# EasyEDA schematic 1-Schematic_IRWAVER_MODULE.json
TITLE: Sheet_1; REV: 1.0; Date: 2022-12-25; Sheet: 1/1; Drawn By: maarnotto; Company: Your Company
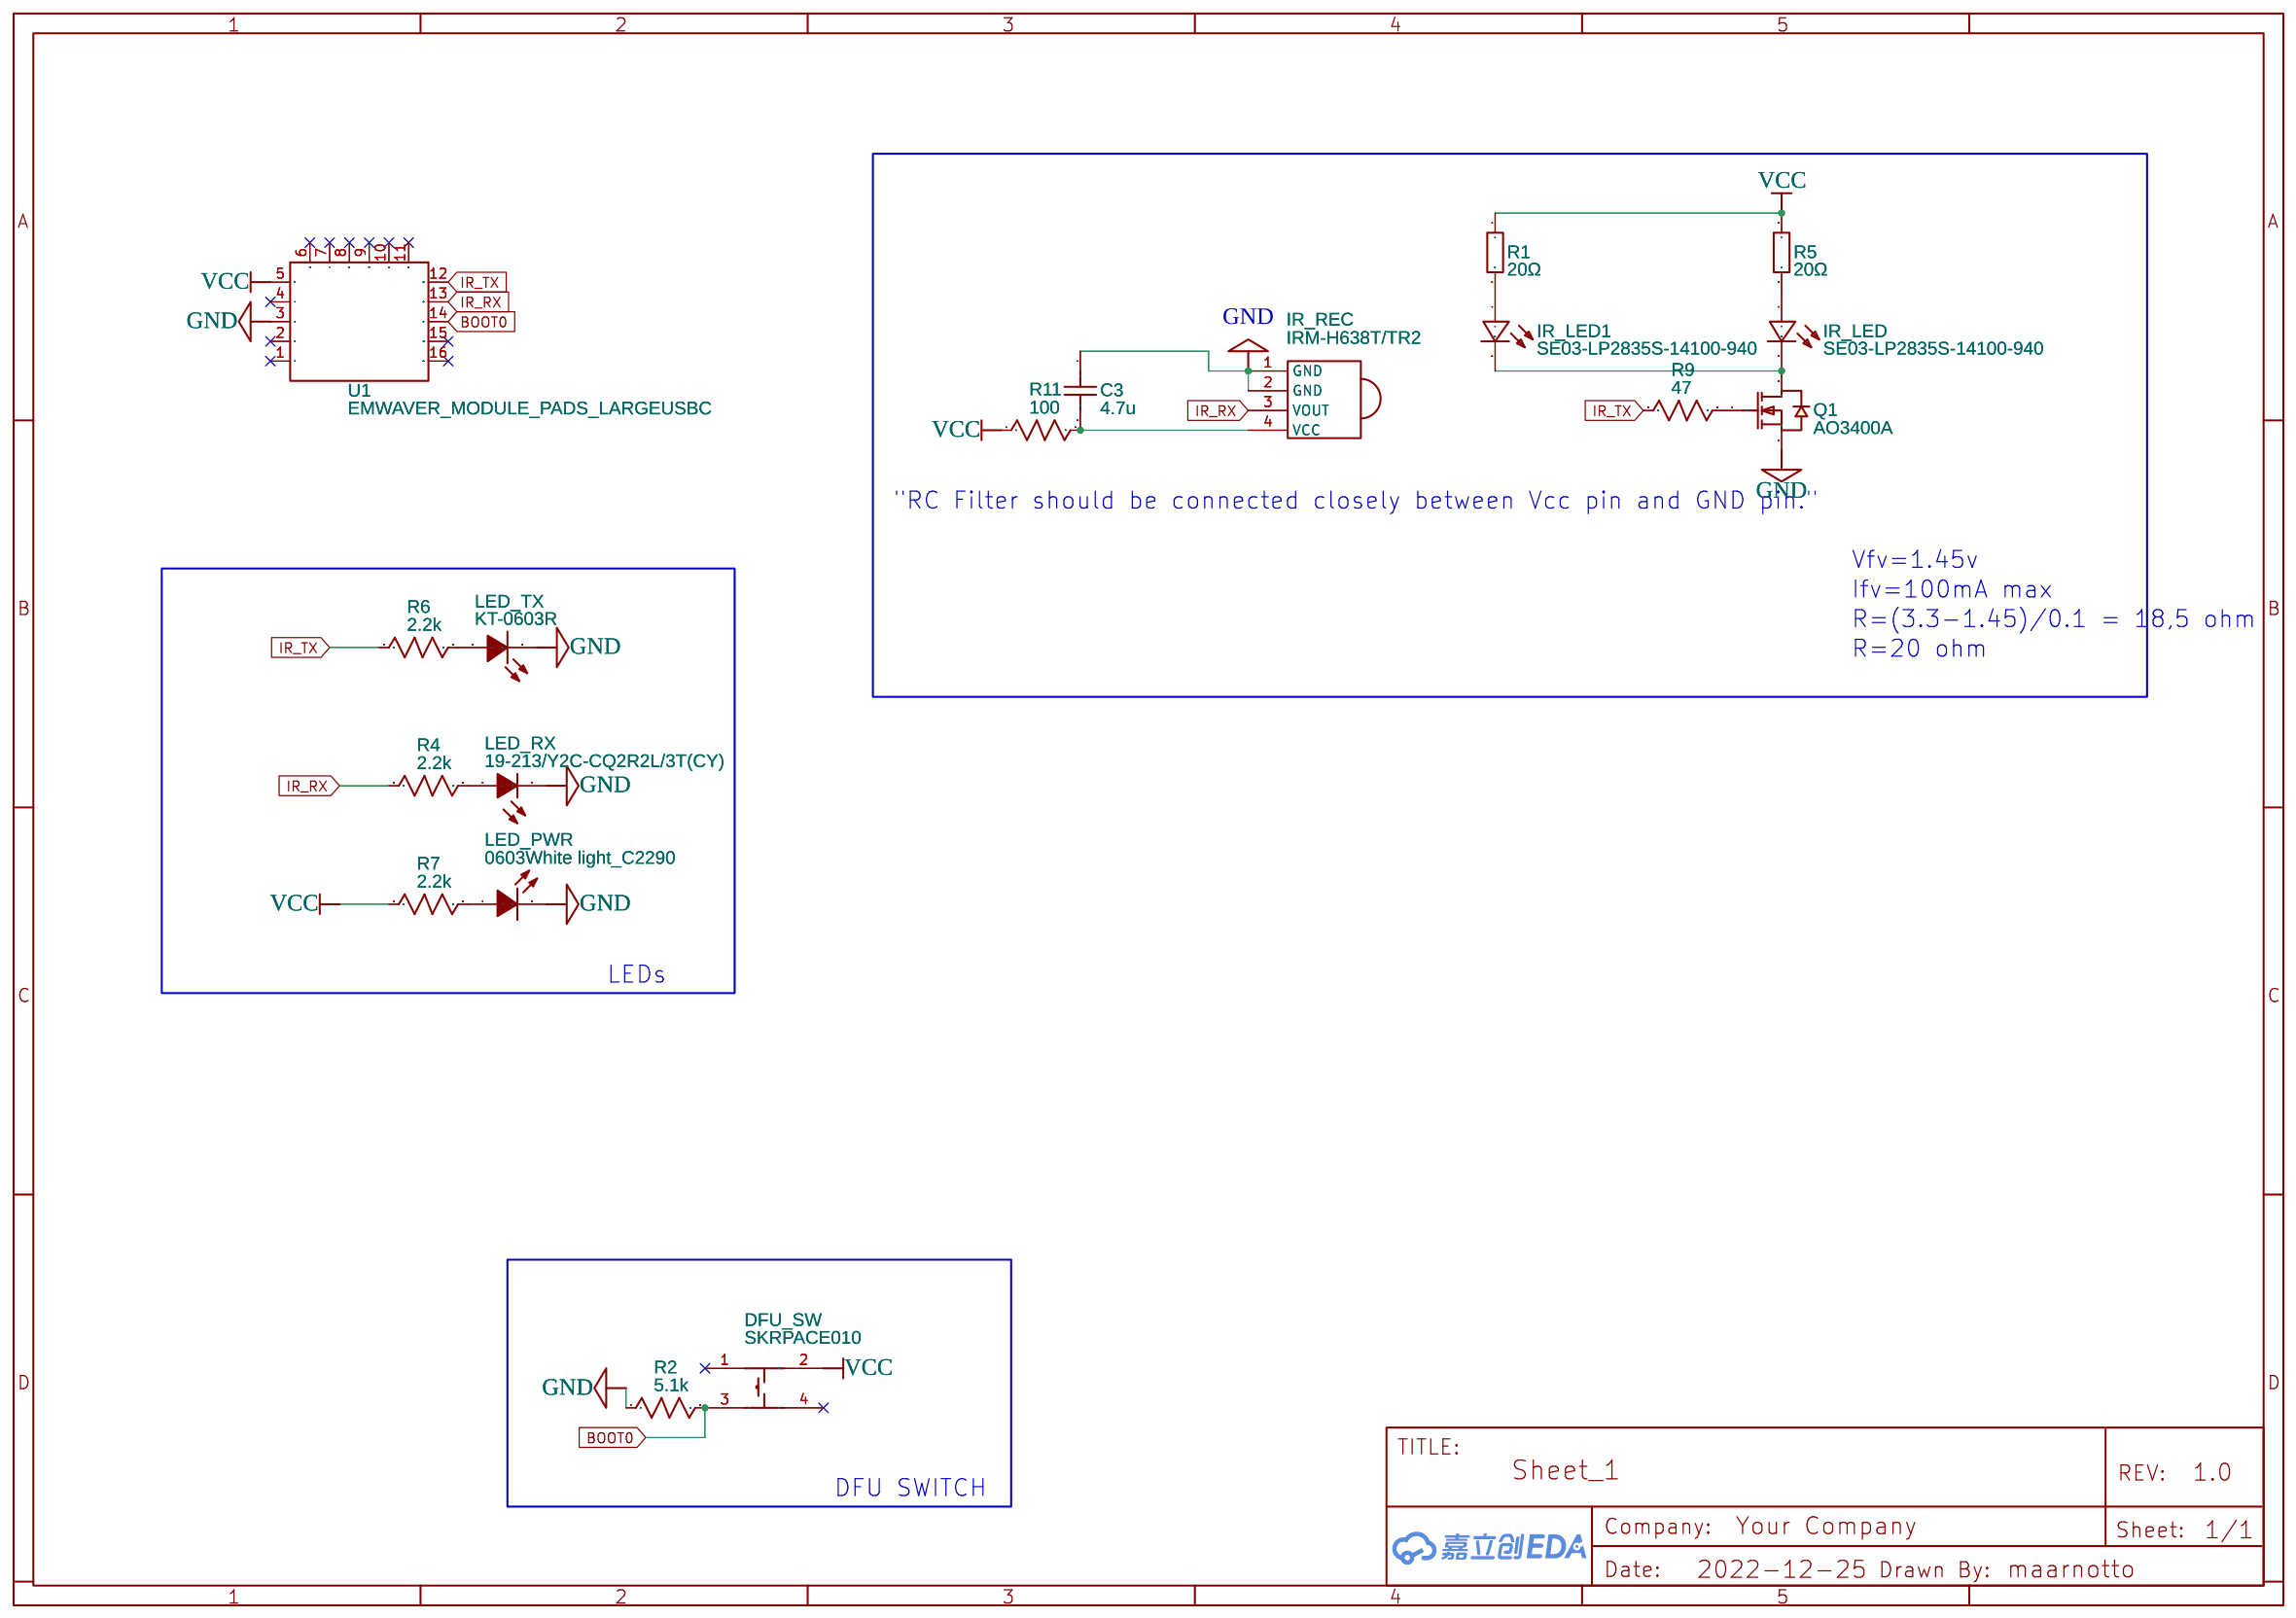
[diagram p0: schematic sheet]

## Parts
C3  4.7u  [C0603]
DFU_SW  SKRPACE010  [KEY-SMD_4P-L4.2-W3.2-P2.20-LS4.6]
IR_LED  SE03-LP2835S-14100-940  [SENSOR-SMD_L3.5-W2.8-FD]
IR_LED1  SE03-LP2835S-14100-940  [SENSOR-SMD_L3.5-W2.8-FD]
IR_REC  IRM-H638T/TR2  [SENSOR-SMD_IRM-H638T-TR2-TL]
LED_PWR  0603White light_C2290  [LED0603-R-RD_WHITE]
LED_RX  19-213/Y2C-CQ2R2L/3T(CY)  [LED0603-RD-YELLOW]
LED_TX  KT-0603R  [LED0603-RD]
Q1  AO3400A  [SOT-23-3_L2.9-W1.6-P1.90-LS2.8-BR]
R1  20Ω  [R1206]
R2  5.1k  [R0603]
R4  2.2k  [R0603]
R5  20Ω  [R1206]
R6  2.2k  [R0603]
R7  2.2k  [R0603]
R9  47  [R0603]
R11  100  [R0603]
U1  EMWAVER_MODULE_PADS_LARGEUSBC  [EMWAVER_MODULE_PADS_FOOTPRINT_LARGEUSBC]

## Library data of the parts
C3 = C_0603_US: Contributor: LCEDA_Lib
DFU_SW = SKRPACE010: Contributor: LCSC; Supplier: LCSC; Manufacturer: ALPSALPINE(阿尔卑斯阿尔派); Supplier Part: C139797; JLCPCB Part Class: Extended Part
IR_LED IR_LED1 = SE03-LP2835S-14100-940: Contributor: lcsc; Supplier: LCSC; Supplier Part: C5205247; Manufacturer: XSSY(旭晟); JLCPCB Part Class: Extended Part
IR_REC = IRM-H638T/TR2: Supplier: LCSC; Manufacturer: EVERLIGHT(亿光); Supplier Part: C91447; JLCPCB Part Class: Extended Part
LED_PWR = 0603White light_C2290: Supplier: LCSC; Manufacturer: null; Manufacturer Part: KT-0603白灯; Supplier Part: C2290; JLCPCB Part Class: Basic Part
LED_RX = 19-213/Y2C-CQ2R2L/3T(CY): Supplier: LCSC; Manufacturer: EVERLIGHT(亿光); Supplier Part: C72038; JLCPCB Part Class: Basic Part
LED_TX = KT-0603R: Supplier: LCSC; Manufacturer: KENTO; Supplier Part: C2286; JLCPCB Part Class: Basic Part
Q1 = AO3400A: Supplier: LCSC; Manufacturer: AOS; Supplier Part: C20917; JLCPCB Part Class: Basic Part
R1 R5 = 1206W4F200JT5E: Supplier: LCSC; Manufacturer: UNI-ROYAL(厚声); Supplier Part: C17955; JLCPCB Part Class: Basic Part
R2 R4 R6 R7 R9 R11 = R_0603_US: Contributor: LCEDA_Lib
U1 = EMWAVER_MODULE_PADS_LARGEUSBC: Contributor: maarnotto

## Nets
GND: C3.1 IR_REC.1(GND) IR_REC.2(GND) LED_PWR.2(K) LED_RX.1(C) LED_TX.1(K) Q1.2(S) R2.1 U1.3
VCC: DFU_SW.2 R1.1 R5.1 R7.1 R11.1 U1.5
BOOT0: DFU_SW.3 R2.2 U1.14
IR_RX: IR_REC.3(VOUT) R4.1 U1.13
IR_TX: R6.1 R9.1 U1.12
Net-(C3-2): C3.2 IR_REC.4(VCC) R11.2
Net-(IR_LED1-1): IR_LED1.1(A) R1.2
Net-(IR_LED-1): IR_LED.1(A) R5.2
Net-(IR_LED-2): IR_LED.2(C) IR_LED1.2(C) Q1.3(D)
Net-(LED_PWR-1): LED_PWR.1(A) R7.2
Net-(LED_RX-2): LED_RX.2(A) R4.2
Net-(LED_TX-2): LED_TX.2(A) R6.2
Net-(Q1-1): Q1.1(G) R9.2

Not connected (* = marked no-connect by the designer): DFU_SW 1* 4*; U1 1* 2* 4* 6* 7* 8* 9* 10* 11* 15* 16*

## Notes on the sheet
- "RC Filter should be connected closely between Vcc pin and GND pin."
- Vfv=1.45v
- Ifv=100mA max
- R=(3.3-1.45)/0.1 = 18,5 ohm
- R=20 ohm
- LEDs
- DFU SWITCH
